# Altium schematic sheet Led 7 Seg 2.3In.SchDoc
size A3; SheetNumber: 2; SheetTotal: 4
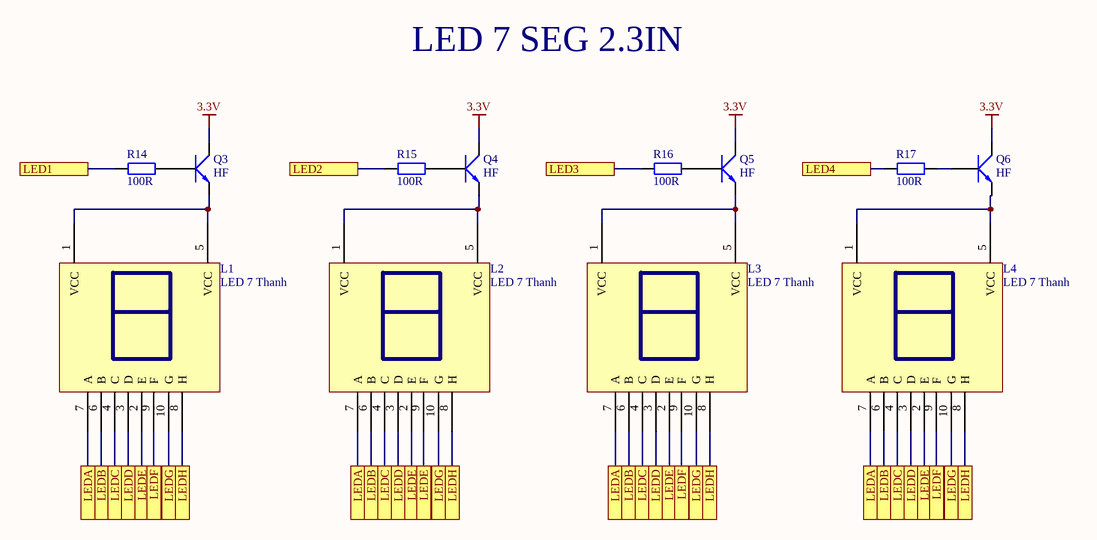
[diagram p0: Led 7 Seg 2.3In.SchDoc]

## Parts
L1  LED 7 Thanh  [LED7SEG_2.3inch]
L2  LED 7 Thanh  [LED7SEG_2.3inch]
L3  LED 7 Thanh  [LED7SEG_2.3inch]
L4  LED 7 Thanh  [LED7SEG_2.3inch]
Q3  HF  [SOT23]
Q4  HF  [SOT23]
Q5  HF  [SOT23]
Q6  HF  [SOT23]
R14  100R  [tro smd 0603]
R15  100R  [tro smd 0603]
R16  100R  [tro smd 0603]
R17  100R  [tro smd 0603]

## Ports
LED1, LED2, LED3, LED4, LEDA, LEDB, LEDC, LEDD, LEDE, LEDF, LEDG, LEDH

## Nets
3.3V: Q3.3(C) Q4.3(C) Q5.3(C) Q6.3(C)
LED1: R14.1 ; port LED1
LED2: R15.1 ; port LED2
LED3: R16.1 ; port LED3
LED4: R17.1 ; port LED4
LEDA: L1.7(A) L2.7(A) L3.7(A) L4.7(A) ; port LEDA
LEDB: L1.6(B) L2.6(B) L3.6(B) L4.6(B) ; port LEDB
LEDC: L1.4(C) L2.4(C) L3.4(C) L4.4(C) ; port LEDC
LEDD: L1.3(D) L2.3(D) L3.3(D) L4.3(D) ; port LEDD
LEDE: L1.2(E) L2.2(E) L2.9(F) L3.2(E) L4.2(E) ; port LEDE
LEDF: L1.9(F) L3.9(F) L4.9(F) ; port LEDF
LEDG: L1.10(G) L2.10(G) L3.10(G) L4.10(G) ; port LEDG
LEDH: L1.8(H) L2.8(H) L3.8(H) L4.8(H) ; port LEDH
NetL1_1: L1.1(VCC) L1.5(VCC) Q3.2(E)
NetL2_1: L2.1(VCC) L2.5(VCC) Q4.2(E)
NetL3_1: L3.1(VCC) L3.5(VCC) Q5.2(E)
NetL4_1: L4.1(VCC) L4.5(VCC) Q6.2(E)
NetQ3_1: Q3.1(B) R14.2
NetQ4_1: Q4.1(B) R15.2
NetQ5_1: Q5.1(B) R16.2
NetQ6_1: Q6.1(B) R17.2

## Notes on the sheet
- LED 7 SEG 2.3IN

## Library data of the parts
L1-L4 = LED 7x1 2.3inch Anot: Dán; Don_Vi: Con; Ma_Hang: MH000901; Ten_Linh_Kien: Led 7 2.3 1 Số Anot (Sáng Đỏ); Ghi_Chu: *; Kieu_Chan: *; Chung_Loai: Dán
Q3-Q6 = C1815 HF SMD: NPN transistor; Value: C9014
R14-R17 = Tro 0603 5% 100R: Dán; Don_Vi: Con; So_Chan: 2; Ten_Linh_Kien: Trở 0603 5% 100R; Ma_Hang: MH006315; Chung_Loai: Dán; Kieu_Chan: *